# EAGLE schematic ledarrows_schematic (EAGLE 6.4)
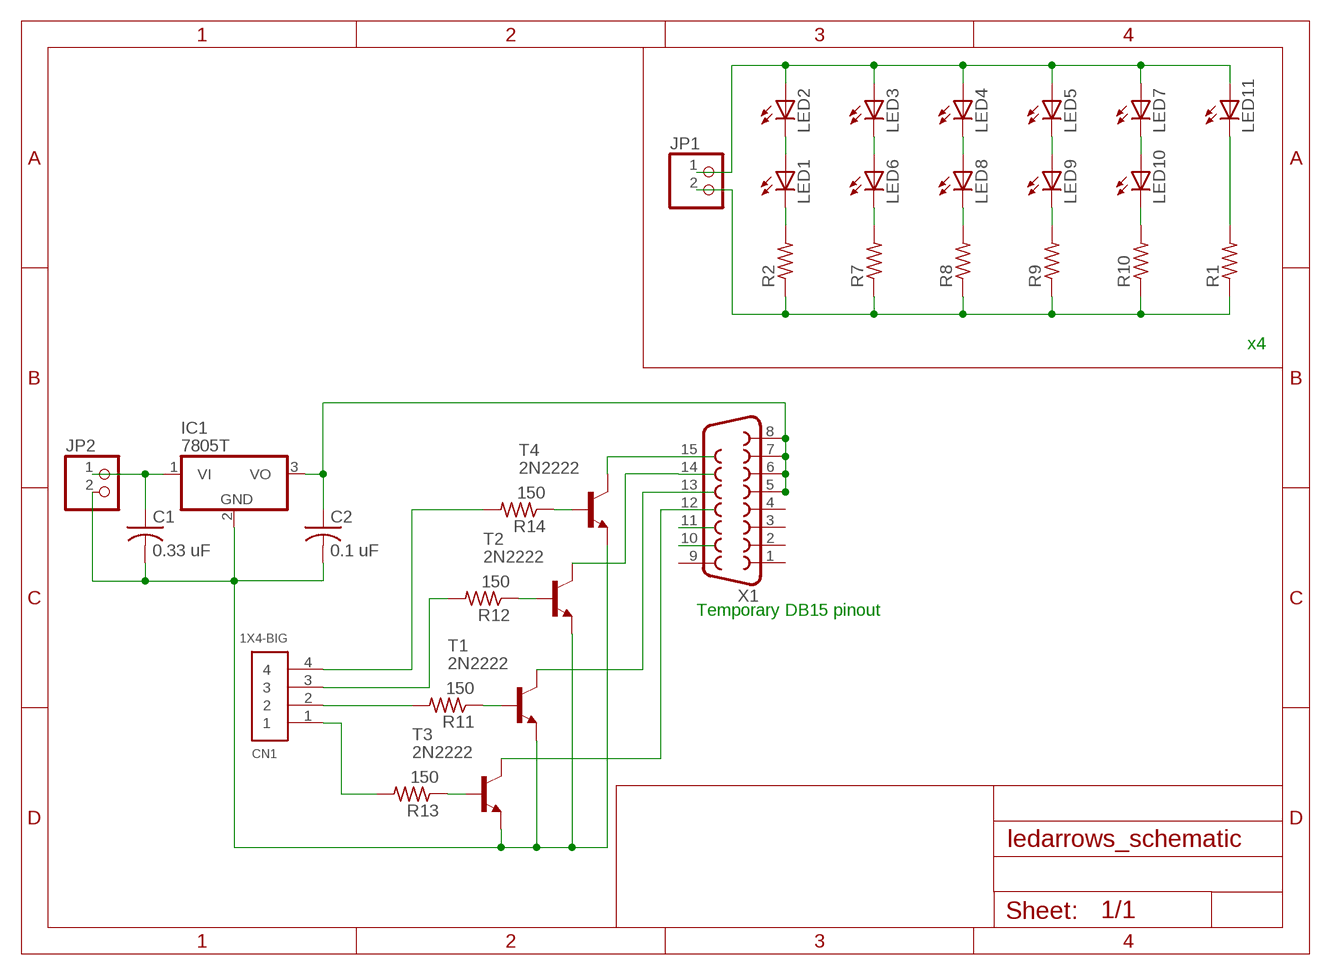
[diagram p0: schematic, sheet 1]

## Parts
C1  0.33 uF  C-US025-050X050  [C025-050X050]
C2  0.1 uF  C-US025-050X050  [C025-050X050]
CN1  1X4-BIG  [1X04-BIG]
IC1  7805T  [TO220H]
JP1  PINHD-1X2  [1X02]
JP2  PINHD-1X2  [1X02]
LED1  LED3MM  [LED3MM]
LED2  LED3MM  [LED3MM]
LED3  LED3MM  [LED3MM]
LED4  LED3MM  [LED3MM]
LED5  LED3MM  [LED3MM]
LED6  LED3MM  [LED3MM]
LED7  LED3MM  [LED3MM]
LED8  LED3MM  [LED3MM]
LED9  LED3MM  [LED3MM]
LED10  LED3MM  [LED3MM]
LED11  LED3MM  [LED3MM]
R1  R-US_0204/7  [0204/7]
R2  R-US_0204/7  [0204/7]
R7  R-US_0204/7  [0204/7]
R8  R-US_0204/7  [0204/7]
R9  R-US_0204/7  [0204/7]
R10  R-US_0204/7  [0204/7]
R11  150  R-US_0204/7  [0204/7]
R12  150  R-US_0204/7  [0204/7]
R13  150  R-US_0204/7  [0204/7]
R14  150  R-US_0204/7  [0204/7]
T1  2N2222  [TO92-EBC-OVAL]
T2  2N2222  [TO92-EBC-OVAL]
T3  2N2222  [TO92-EBC-OVAL]
T4  2N2222  [TO92-EBC-OVAL]
X1  F15H  [F15H]

## Nets
N$1: LED10.K(C) R10.2
N$2: LED1.A LED2.K(C)
N$3: LED3.K(C) LED6.A
N$4: JP1.1 LED2.A LED3.A LED4.A LED5.A LED7.A LED11.A
N$5: R11.1 T1.B
N$6: LED4.K(C) LED8.A
N$7: LED5.K(C) LED9.A
N$8: LED9.K(C) R9.2
N$9: LED8.K(C) R8.2
N$10: LED7.K(C) LED10.A
N$11: LED11.K(C) R1.2
N$15: LED1.K(C) R2.2
N$16: LED6.K(C) R7.2
N$18: JP1.2 R1.1 R2.1 R7.1 R8.1 R9.1 R10.1
N$19: C1.1 IC1.1(VI) JP2.1
N$20: CN1.1 R13.2
N$21: R12.1 T2.B
N$22: C2.1 IC1.3(VO) X1.5 X1.6 X1.7 X1.8
N$23: R13.1 T3.B
N$24: R14.1 T4.B
N$25: T1.C X1.13
N$26: CN1.2 R11.2
N$27: CN1.3 R12.2
N$28: CN1.4 R14.2
N$29: C1.2 C2.2 IC1.2(GND) JP2.2 T1.E T2.E T3.E T4.E
N$30: T3.C X1.12
N$31: X1.11
N$34: T4.C X1.15
N$36: X1.10
N$38: T2.C X1.14
Unconnected: X1.1 X1.2 X1.3 X1.4 X1.9

## Notes on the sheet
- x4
- Temporary DB15 pinout

## Library data of the parts
C1 C2 = adafruit:C-US: CAPACITOR, American symbol
CN1 = adafruit:1X4: 4-pin connector
IC1 = adafruit:78*: Positive VOLTAGE REGULATOR Added bigger pads to the TO-92 package
JP1 JP2 = pinhead:PINHD-1X2: PIN HEADER
LED1-LED11 = adafruit:LED: LED OSRAM: - CHIPLED LG R971, LG N971, LY N971, LG Q971, LY Q971, LO R971, LY R971 LH N974, LH R974 LS Q976, LO Q976, LY Q976 LO Q996 - Hyper CHIPLED LW Q18S LB Q993, LB Q99A, LB R99A - SideLED LS A670, LO A670, LY A670, LG A670, LP A670 LB A673, LV A673, LT A673, LW A673 LH A674 LY A675 LS A676, LA A676, LO A676, LY A676, LW A676 LS A679, LY A679, LG A679 - Hyper Micro SIDELED® LS Y876, LA Y876, LO Y876, LY Y876 LT Y87S - SmartLED LW L88C, LW L88S LB L89C, LB L89S, LG L890 LS L89K, LO L89K, LY L89K LS L896, LA L896, LO L896, LY L896 - TOPLED LS T670, LO T670, LY T670, LG T670, LP T670 LSG T670, LSP T670, LSY T670, LOP T670, LYG T670 LG T671, LOG T671, LSG T671 LB T673, LV T673, LT T673, LW T673 LH T674 LS T676, LA T676, LO T676, LY T676, LB T676, LH T676, LSB T676, LW T676 LB T67C, LV T67C, LT T67C, LS T67K, LO T67K, LY T67K, LW E67C LS E67B, LA E67B, LO E67B, LY E67B, LB E67C, LV E67C, LT E67C LW T67C LS T679, LY T679, LG T679 LS T770, LO T770, LY T770, LG T770, LP T770 LB T773, LV T773, LT T773, LW T773 LH T774 LS E675, LA E675, LY E675, LS T675 LS T776, LA T776, LO T776, LY T776, LB T776 LHGB T686 LT T68C, LB T68C - Hyper Mini TOPLED® LB M676 - Mini TOPLED Santana® LG M470 LS M47K, LO M47K, LY M47K Source: http://www.osram.convergy.de/
R1 R2 R7-R14 = adafruit:R-US_: RESISTOR, American symbol
T1-T4 = adafruit:2N2222: NPN TRANSISTOR Big oval pads
X1 = adafruit:F15: SUB-D HDH is also known as a 'right angle VGA' connector